# EAGLE design Filter (EAGLE 9.6.2)
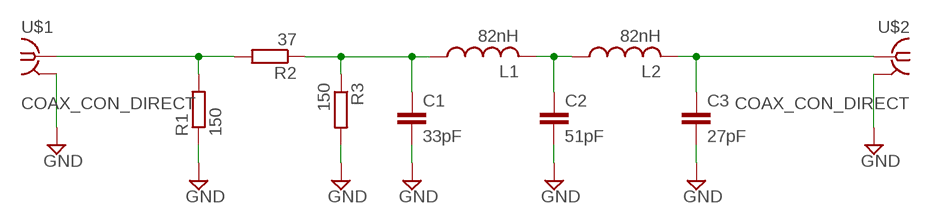
[diagram p0: schematic, sheet 1]

## Parts
C1  33pF  C-EUC0805  [C0805]
C2  51pF  C-EUC0805  [C0805]
C3  27pF  C-EUC0805  [C0805]
L1  82nH  L-USL2012C  [L2012C]
L2  82nH  L-USL2012C  [L2012C]
R1  150  R-EU_R0805  [R0805]
R2  37  R-EU_R0805  [R0805]
R3  150  R-EU_R0805  [R0805]
U$1  COAX_CON_DIRECT  [COAX.141]
U$2  COAX_CON_DIRECT  [COAX.141]

## Nets
GND: C1.2 C2.2 C3.2 R1.1 R3.2 U$1.P$2(GND) U$2.P$2(GND)
N$1: C3.1 L2.2 U$2.P$1
N$2: C2.1 L1.2 L2.1
N$3: C1.1 L1.1 R2.1 R3.1
N$5: R1.2 R2.2 U$1.P$1

## Library data of the parts
C1-C3 = rcl:C-EU: CAPACITOR, European symbol; SPICEPREFIX: C
L1 L2 = rcl:L-US: INDUCTOR, American symbol; SPICEPREFIX: L
R1-R3 = rcl:R-EU_: RESISTOR, European symbol; SPICEPREFIX: R
U$1 U$2 = Orzada:COAX_CON_DIRECT: Direct Coax to Bord Top

## Board
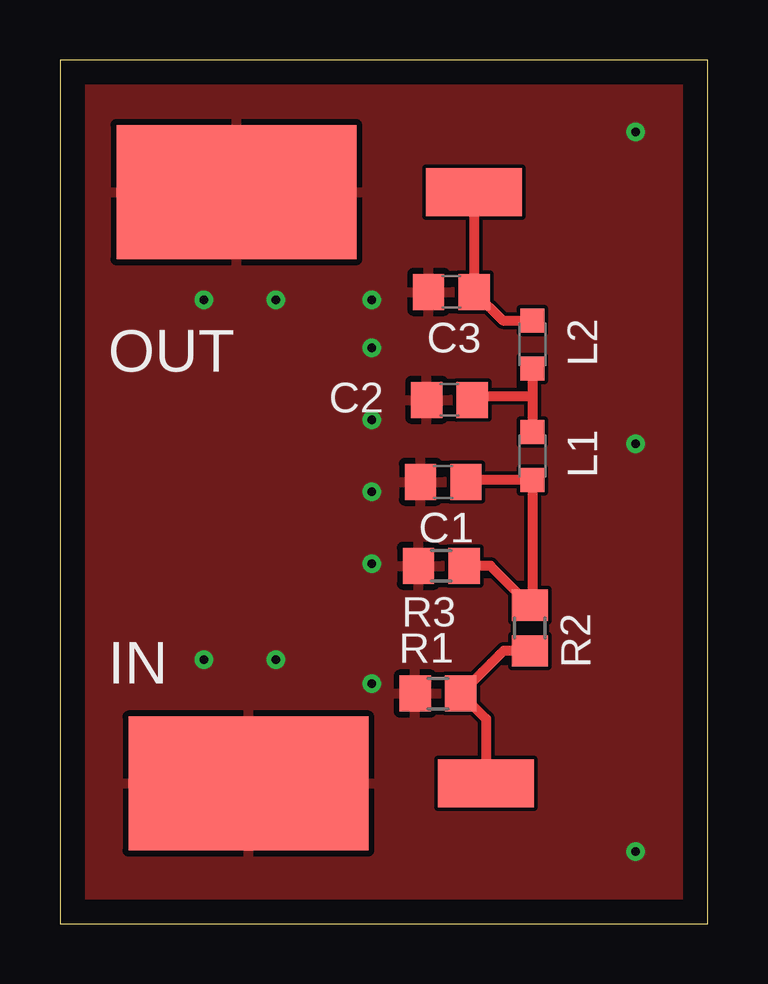
[diagram p1: board, top side]
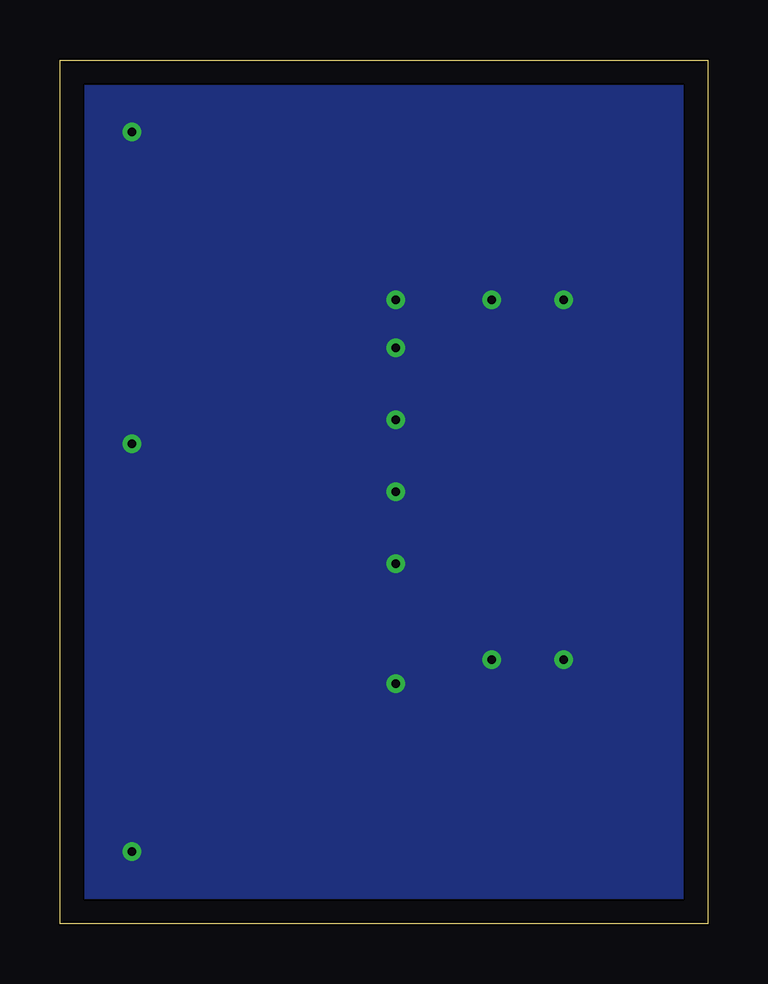
[diagram p2: board, bottom side, seen from below]

Size 27 x 36 mm. Coordinates in mm from the lower left corner, seen from the top.
Outline: 0,0 27,0 27,36 0,36 0,0
Copper layers (1*16): Top 0.035mm / dielectric 1.5mm / Bottom 0.035mm
Design rules "default": minimum track width 6mil, minimum drill 0.35mm, track to track 6mil, track to pad 6mil, pad to pad 6mil, via to via 6mil, smd to smd 6mil, copper to edge 40mil, drill to drill 6mil, minimum pad ring 10mil, minimum via ring 8mil, stop-mask expansion 4mil, vias tented up to drill 0mil, thermal gap 10mil

### Footprints (pad centres in the part's own frame; a part is rotated, then mirrored left to right if it is on the bottom)
C0805 = smd 1.3 x 1.5: 1 -0.95,0; 2 0.95,0
L2012C = smd 1 x 1: 1 -1,0; 2 1,0
R0805 = smd 1.3 x 1.5: 1 -0.95,0; 2 0.95,0
COAX.141 = smd 4 x 2: P$1 -3.364,0 | smd 10 x 5.588: P$2 6.546,0

### Placement (x,y rotation side)
C1  15.98,18.41 180 top
C2  16.24,21.83 180 top
C3  16.32,26.33 180 top
L1  19.69,19.49 90 top
L2  19.69,24.14 90 top
R1  15.76,9.59 0 top
R2  19.59,12.32 270 top
R3  15.9,14.91 180 top
U$1  14.4,5.84 180 top
U$2  13.9,30.49 180 top

### Tracks (layer width: path | path; a pad name or v marks a point on that pad's centre or on a via)
GND  (via drill 0.35)
  other vias: 6,26 9,26 6,11 9,11 24,33 24,20 24,3 13,10 13,15 13,18 13,21 13,26 13,24
  pour Top: 1,35 1,1 26,1 26,35
  pour Bottom: 1,35 26,35 26,1 1,1
N$1
  Top 0.406: U$2.P$1 C3.1 18.46,25.14 L2.2
N$2
  Top 0.406: L2.1 19.69,22 | 19.69,22 L1.2 | C2.1 17.36,22 19.69,22
N$3
  Top 0.406: C1.1 17.01,18.49 L1.1 19.69,13.37 R2.1 17.95,14.91 R3.1
N$5
  Top 0.406: R2.2 18.49,11.37 R1.2 17.76,8.54 U$1.P$1

### Text on the board
tNames: OUT | IN